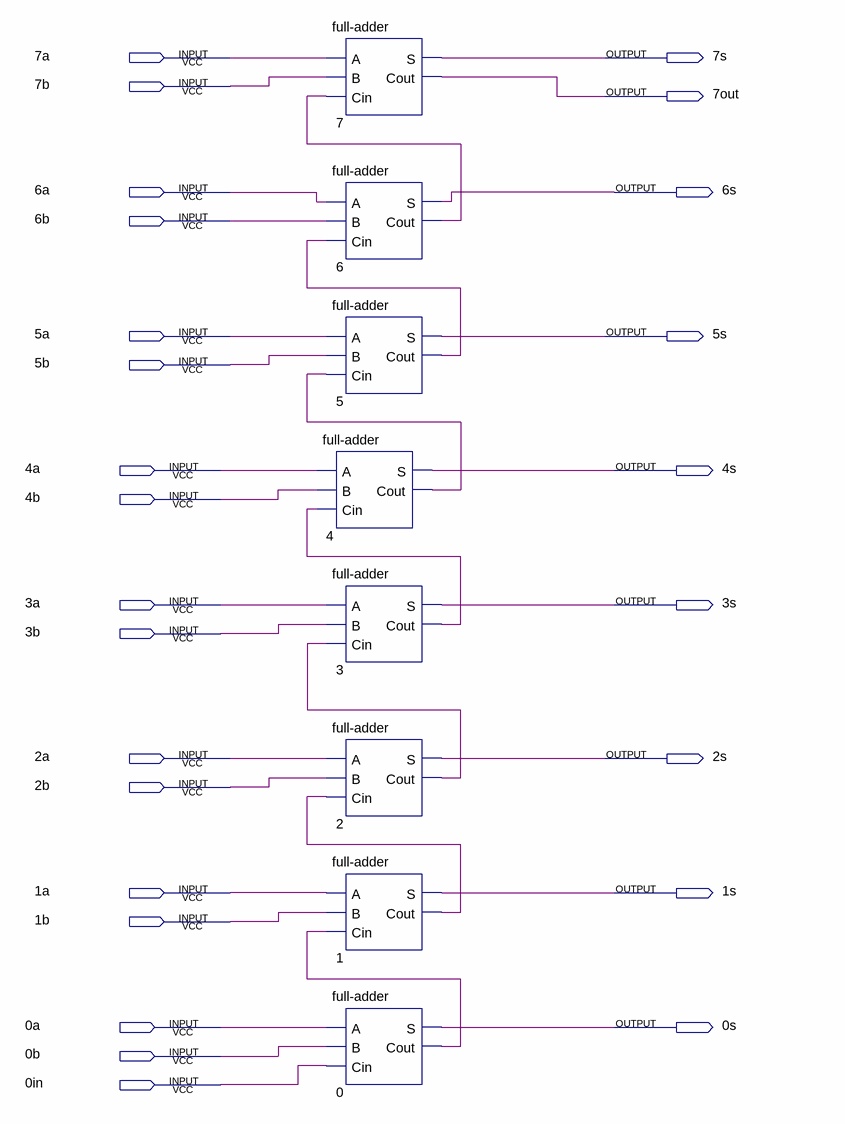
[diagram p0: schematic sheet]
// Quartus schematic 8-bit-adder.bdf as structural Verilog: 8 symbols, 26 pins
module \8-bit-adder  (
  input  \7a ,
  input  \7b ,
  input  \6a ,
  input  \6b ,
  input  \5a ,
  input  \5b ,
  input  \4a ,
  input  \4b ,
  input  \3a ,
  input  \3b ,
  input  \2a ,
  input  \2b ,
  input  \1a ,
  input  \1b ,
  input  \0a ,
  input  \0b ,
  input  \0in ,
  output \7s ,
  output \7out ,
  output \6s ,
  output \5s ,
  output \4s ,
  output \3s ,
  output \2s ,
  output \1s ,
  output \0s 
);

  wire n0_cout, n1_cout, n2_cout, n3_cout, n4_cout, n5_cout, n6_cout;

  \full-adder  u_7 (.A(\7a ), .B(\7b ), .Cin(n6_cout), .S(\7s ), .Cout(\7out ));
  \full-adder  u_6 (.A(\6a ), .B(\6b ), .Cin(n5_cout), .S(\6s ), .Cout(n6_cout));
  \full-adder  u_5 (.A(\5a ), .B(\5b ), .Cin(n4_cout), .S(\5s ), .Cout(n5_cout));
  \full-adder  u_4 (.A(\4a ), .B(\4b ), .Cin(n3_cout), .S(\4s ), .Cout(n4_cout));
  \full-adder  u_3 (.A(\3a ), .B(\3b ), .Cin(n2_cout), .S(\3s ), .Cout(n3_cout));
  \full-adder  u_2 (.A(\2a ), .B(\2b ), .Cin(n1_cout), .S(\2s ), .Cout(n2_cout));
  \full-adder  u_1 (.A(\1a ), .B(\1b ), .Cin(n0_cout), .S(\1s ), .Cout(n1_cout));
  \full-adder  u_0 (.A(\0a ), .B(\0b ), .Cin(\0in ), .S(\0s ), .Cout(n0_cout));
endmodule
